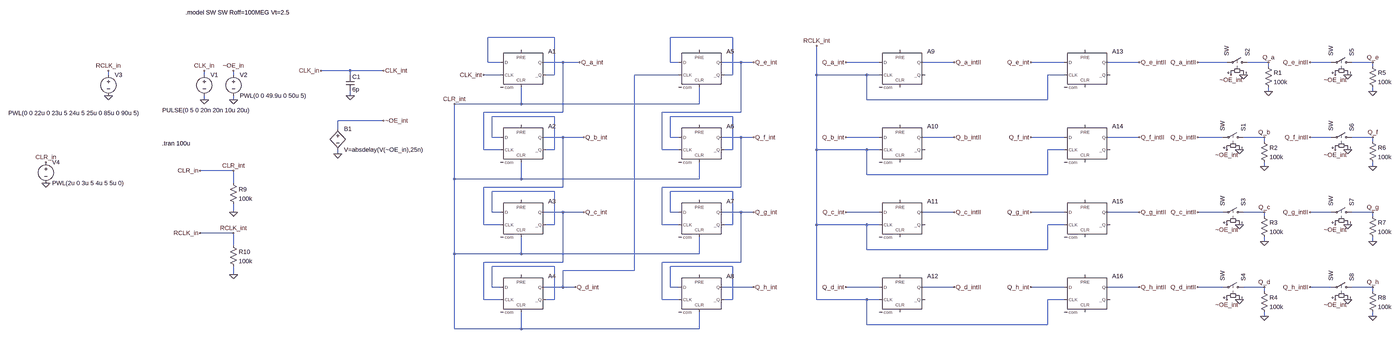
[diagram p0: schematic Draft4.asc, whole sheet]
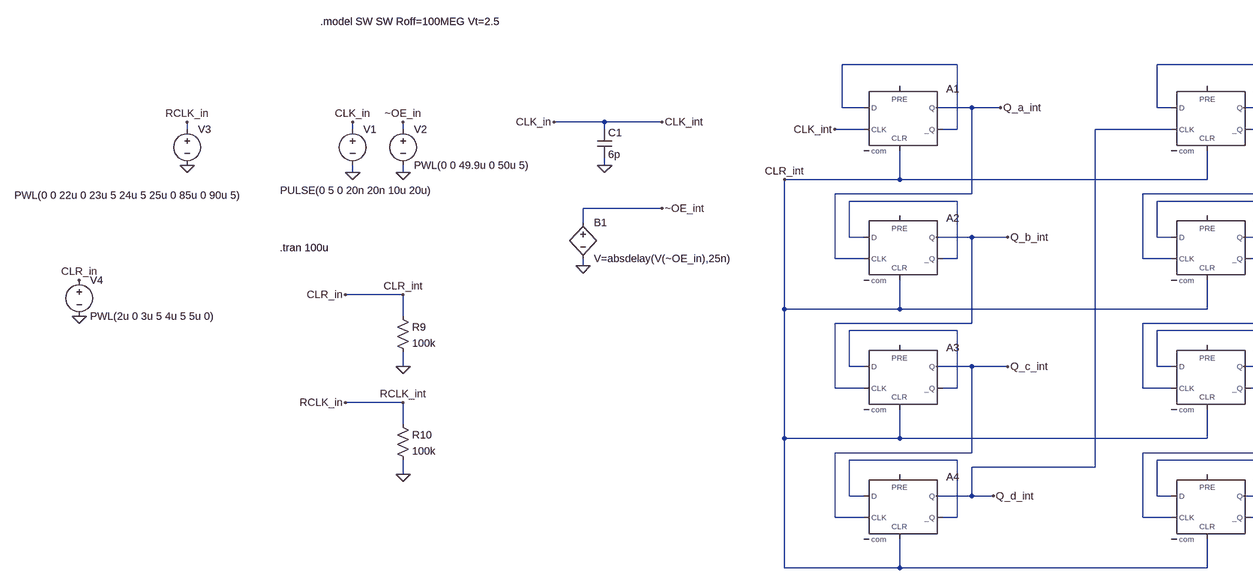
[diagram p1: schematic Draft4.asc, part, row 1 of 1, column 1 of 2]
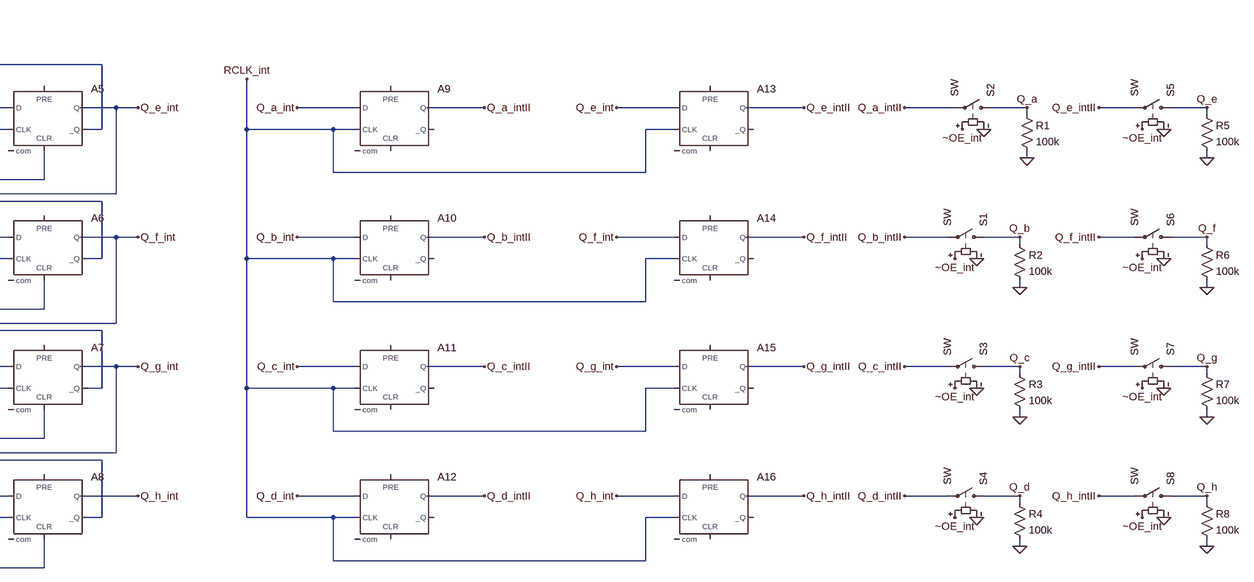
[diagram p2: schematic Draft4.asc, part, row 1 of 1, column 2 of 2]
Draft4.asc, the LTspice schematic file:
Version 4
SHEET 1 3744 1060
WIRE 304 -96 48 -96
WIRE 1088 -96 848 -96
WIRE 48 0 48 -96
WIRE 96 0 48 0
WIRE 336 0 256 0
WIRE 400 0 336 0
WIRE 848 0 848 -96
WIRE 880 0 848 0
WIRE 1120 0 1040 0
WIRE 1168 0 1120 0
WIRE 1760 0 1632 0
WIRE 2048 0 1920 0
WIRE 2480 0 2352 0
WIRE 2768 0 2640 0
WIRE 3104 0 2992 0
WIRE 3264 0 3184 0
WIRE 3504 0 3424 0
WIRE 3664 0 3584 0
WIRE 3264 16 3264 0
WIRE 3664 16 3664 0
WIRE -480 32 -592 32
WIRE -352 32 -480 32
WIRE -1408 48 -1408 32
WIRE -1040 48 -1040 32
WIRE -928 48 -928 32
WIRE -480 48 -480 32
WIRE 96 48 32 48
WIRE 304 48 304 -96
WIRE 304 48 272 48
WIRE 880 48 704 48
WIRE 1088 48 1088 -96
WIRE 1088 48 1056 48
WIRE 1520 48 1520 -64
WIRE 1712 48 1520 48
WIRE 1760 48 1712 48
WIRE 2480 48 2416 48
WIRE 3264 112 3264 96
WIRE 3664 112 3664 96
WIRE -480 128 -480 112
WIRE -1040 144 -1040 128
WIRE -928 144 -928 128
WIRE 1712 144 1712 48
WIRE 2416 144 2416 48
WIRE 2416 144 1712 144
WIRE 176 160 176 96
WIRE 176 160 -80 160
WIRE 960 160 960 96
WIRE 960 160 176 160
WIRE 336 192 336 0
WIRE 336 192 32 192
WIRE 1120 192 1120 0
WIRE 1120 192 816 192
WIRE 304 208 64 208
WIRE 1088 208 848 208
WIRE -352 224 -528 224
WIRE -528 256 -528 224
WIRE 64 288 64 208
WIRE 96 288 64 288
WIRE 336 288 256 288
WIRE 416 288 336 288
WIRE 848 288 848 208
WIRE 880 288 848 288
WIRE 1120 288 1040 288
WIRE 1168 288 1120 288
WIRE 1760 288 1632 288
WIRE 2048 288 1920 288
WIRE 2480 288 2352 288
WIRE 2768 288 2640 288
WIRE 3088 288 2992 288
WIRE 3248 288 3168 288
WIRE 3504 288 3424 288
WIRE 3664 288 3584 288
WIRE 3248 304 3248 288
WIRE 3664 304 3664 288
WIRE 32 336 32 192
WIRE 96 336 32 336
WIRE 304 336 304 208
WIRE 304 336 272 336
WIRE 816 336 816 192
WIRE 880 336 816 336
WIRE 1088 336 1088 208
WIRE 1088 336 1056 336
WIRE 1520 336 1520 48
WIRE 1712 336 1520 336
WIRE 1760 336 1712 336
WIRE 2480 336 2416 336
WIRE -528 352 -528 336
WIRE 3248 400 3248 384
WIRE 3664 400 3664 384
WIRE -928 416 -1056 416
WIRE 1712 432 1712 336
WIRE 2416 432 2416 336
WIRE 2416 432 1712 432
WIRE -80 448 -80 160
WIRE 176 448 176 384
WIRE 176 448 -80 448
WIRE 960 448 960 384
WIRE 960 448 176 448
WIRE -928 464 -928 416
WIRE 336 480 336 288
WIRE 336 480 32 480
WIRE 1120 480 1120 288
WIRE 1120 480 816 480
WIRE 304 496 64 496
WIRE 1088 496 848 496
WIRE -928 576 -928 544
WIRE 64 576 64 496
WIRE 96 576 64 576
WIRE 336 576 256 576
WIRE 416 576 336 576
WIRE 848 576 848 496
WIRE 880 576 848 576
WIRE 1120 576 1040 576
WIRE 1168 576 1120 576
WIRE 1760 576 1632 576
WIRE 2048 576 1920 576
WIRE 2480 576 2352 576
WIRE 2768 576 2640 576
WIRE 3088 576 2992 576
WIRE 3248 576 3168 576
WIRE 3504 576 3424 576
WIRE 3664 576 3584 576
WIRE 3248 592 3248 576
WIRE 3664 592 3664 576
WIRE 32 624 32 480
WIRE 96 624 32 624
WIRE 304 624 304 496
WIRE 304 624 272 624
WIRE 816 624 816 480
WIRE 880 624 816 624
WIRE 1088 624 1088 496
WIRE 1088 624 1056 624
WIRE 1520 624 1520 336
WIRE 1712 624 1520 624
WIRE 1760 624 1712 624
WIRE 2480 624 2416 624
WIRE -928 656 -1056 656
WIRE 3248 688 3248 672
WIRE 3664 688 3664 672
WIRE -928 704 -928 656
WIRE 1712 720 1712 624
WIRE 2416 720 2416 624
WIRE 2416 720 1712 720
WIRE -80 736 -80 448
WIRE 176 736 176 672
WIRE 176 736 -80 736
WIRE 960 736 960 672
WIRE 960 736 176 736
WIRE 336 768 336 576
WIRE 336 768 32 768
WIRE 1120 768 1120 576
WIRE 1120 768 816 768
WIRE 304 784 64 784
WIRE 1088 784 848 784
WIRE 704 800 704 48
WIRE 704 800 336 800
WIRE -928 816 -928 784
WIRE 64 864 64 784
WIRE 96 864 64 864
WIRE 336 864 336 800
WIRE 336 864 256 864
WIRE 384 864 336 864
WIRE 848 864 848 784
WIRE 880 864 848 864
WIRE 1168 864 1040 864
WIRE 1760 864 1632 864
WIRE 2048 864 1920 864
WIRE 2480 864 2352 864
WIRE 2768 864 2640 864
WIRE 3088 864 2992 864
WIRE 3248 864 3168 864
WIRE 3504 864 3424 864
WIRE 3664 864 3584 864
WIRE 3248 880 3248 864
WIRE 3664 880 3664 864
WIRE 32 912 32 768
WIRE 96 912 32 912
WIRE 304 912 304 784
WIRE 304 912 272 912
WIRE 816 912 816 768
WIRE 880 912 816 912
WIRE 1088 912 1088 784
WIRE 1088 912 1056 912
WIRE 1520 912 1520 624
WIRE 1712 912 1520 912
WIRE 1760 912 1712 912
WIRE 2480 912 2416 912
WIRE 3248 976 3248 960
WIRE 3664 976 3664 960
WIRE 1712 1008 1712 912
WIRE 2416 1008 2416 912
WIRE 2416 1008 1712 1008
WIRE -80 1024 -80 736
WIRE 176 1024 176 960
WIRE 176 1024 -80 1024
WIRE 960 1024 960 960
WIRE 960 1024 176 1024
FLAG -592 32 CLK_in
FLAG -352 32 CLK_int
FLAG 32 48 CLK_int
FLAG -480 128 0
FLAG -352 224 ~OE_int
FLAG 3120 48 ~OE_int
FLAG 400 0 Q_a_int
FLAG -928 144 0
FLAG -1040 144 0
FLAG -1040 32 CLK_in
FLAG -928 32 ~OE_in
FLAG -528 352 0
FLAG 3168 48 0
FLAG 3264 112 0
FLAG 3104 336 ~OE_int
FLAG 416 288 Q_b_int
FLAG 3152 336 0
FLAG 3248 400 0
FLAG 3104 624 ~OE_int
FLAG 416 576 Q_c_int
FLAG 3152 624 0
FLAG 3248 688 0
FLAG 3104 912 ~OE_int
FLAG 384 864 Q_d_int
FLAG 3152 912 0
FLAG 3248 976 0
FLAG 3520 48 ~OE_int
FLAG 1168 0 Q_e_int
FLAG 3568 48 0
FLAG 3664 112 0
FLAG 3520 336 ~OE_int
FLAG 1168 288 Q_f_int
FLAG 3568 336 0
FLAG 3664 400 0
FLAG 3520 624 ~OE_int
FLAG 1168 576 Q_g_int
FLAG 3568 624 0
FLAG 3664 688 0
FLAG 3520 912 ~OE_int
FLAG 1168 864 Q_h_int
FLAG 3568 912 0
FLAG 3664 976 0
FLAG -80 160 CLR_int
FLAG -1056 416 CLR_in
FLAG -928 576 0
FLAG 1632 0 Q_a_int
FLAG 1632 288 Q_b_int
FLAG 1632 576 Q_c_int
FLAG 1632 864 Q_d_int
FLAG -1056 656 RCLK_in
FLAG -928 816 0
FLAG -928 416 CLR_int
FLAG -928 656 RCLK_int
FLAG 1520 -64 RCLK_int
FLAG 2048 0 Q_a_intII
FLAG 2048 288 Q_b_intII
FLAG 2048 576 Q_c_intII
FLAG 2048 864 Q_d_intII
FLAG 2352 0 Q_e_int
FLAG 2352 288 Q_f_int
FLAG 2352 576 Q_g_int
FLAG 2352 864 Q_h_int
FLAG 2768 0 Q_e_intII
FLAG 2768 288 Q_f_intII
FLAG 2768 576 Q_g_intII
FLAG 2768 864 Q_h_intII
FLAG 3424 0 Q_e_intII
FLAG 3424 288 Q_f_intII
FLAG 3424 576 Q_g_intII
FLAG 3424 864 Q_h_intII
FLAG 2992 0 Q_a_intII
FLAG 2992 288 Q_b_intII
FLAG 2992 576 Q_c_intII
FLAG 2992 864 Q_d_intII
FLAG 3264 0 Q_a
FLAG 3248 288 Q_b
FLAG 3248 576 Q_c
FLAG 3248 864 Q_d
FLAG 3664 0 Q_e
FLAG 3664 288 Q_f
FLAG 3664 576 Q_g
FLAG 3664 864 Q_h
FLAG -1408 128 0
FLAG -1408 32 RCLK_in
FLAG -1648 464 0
FLAG -1648 384 CLR_in
SYMBOL Digital\\dflop 176 -48 R0
SYMATTR InstName A1
SYMATTR SpiceLine Vhigh=5 Vlow=0 Td=25n
SYMBOL cap -496 48 R0
SYMATTR InstName C1
SYMATTR Value 6p
SYMBOL sw 3200 0 M270
SYMATTR InstName S2
SYMBOL voltage -1040 32 R0
WINDOW 3 -161 152 Left 2
WINDOW 123 0 0 Left 0
WINDOW 39 0 0 Left 0
SYMATTR InstName V1
SYMATTR Value PULSE(0 5 0 20n 20n 10u 20u)
SYMBOL voltage -928 32 R0
WINDOW 123 0 0 Left 0
WINDOW 39 0 0 Left 0
SYMATTR InstName V2
SYMATTR Value PWL(0 0 49.9u 0 50u 5)
SYMBOL bv -528 240 R0
SYMATTR InstName B1
SYMATTR Value V=absdelay(V(~OE_in),25n)
SYMBOL res 3248 0 R0
SYMATTR InstName R1
SYMATTR Value 100k
SYMBOL Digital\\dflop 176 240 R0
SYMATTR InstName A2
SYMATTR SpiceLine Vhigh=5 Vlow=0 Td=25n
SYMBOL sw 3184 288 M270
SYMATTR InstName S1
SYMBOL res 3232 288 R0
SYMATTR InstName R2
SYMATTR Value 100k
SYMBOL Digital\\dflop 176 528 R0
SYMATTR InstName A3
SYMATTR SpiceLine Vhigh=5 Vlow=0 Td=25n
SYMBOL sw 3184 576 M270
SYMATTR InstName S3
SYMBOL res 3232 576 R0
SYMATTR InstName R3
SYMATTR Value 100k
SYMBOL Digital\\dflop 176 816 R0
SYMATTR InstName A4
SYMATTR SpiceLine Vhigh=5 Vlow=0 Td=25n
SYMBOL sw 3184 864 M270
SYMATTR InstName S4
SYMBOL res 3232 864 R0
SYMATTR InstName R4
SYMATTR Value 100k
SYMBOL Digital\\dflop 960 -48 R0
SYMATTR InstName A5
SYMATTR SpiceLine Vhigh=5 Vlow=0 Td=25n
SYMBOL sw 3600 0 M270
SYMATTR InstName S5
SYMBOL res 3648 0 R0
SYMATTR InstName R5
SYMATTR Value 100k
SYMBOL Digital\\dflop 960 240 R0
SYMATTR InstName A6
SYMATTR SpiceLine Vhigh=5 Vlow=0 Td=25n
SYMBOL sw 3600 288 M270
SYMATTR InstName S6
SYMBOL res 3648 288 R0
SYMATTR InstName R6
SYMATTR Value 100k
SYMBOL Digital\\dflop 960 528 R0
SYMATTR InstName A7
SYMATTR SpiceLine Vhigh=5 Vlow=0 Td=25n
SYMBOL sw 3600 576 M270
SYMATTR InstName S7
SYMBOL res 3648 576 R0
SYMATTR InstName R7
SYMATTR Value 100k
SYMBOL Digital\\dflop 960 816 R0
SYMATTR InstName A8
SYMATTR SpiceLine Vhigh=5 Vlow=0 Td=25n
SYMBOL sw 3600 864 M270
SYMATTR InstName S8
SYMBOL res 3648 864 R0
SYMATTR InstName R8
SYMATTR Value 100k
SYMBOL res -944 448 R0
SYMATTR InstName R9
SYMATTR Value 100k
SYMBOL Digital\\dflop 1840 -48 R0
SYMATTR InstName A9
SYMATTR SpiceLine Vhigh=5 Vlow=0 Td=25n
SYMBOL Digital\\dflop 1840 240 R0
SYMATTR InstName A10
SYMATTR SpiceLine Vhigh=5 Vlow=0 Td=25n
SYMBOL Digital\\dflop 1840 528 R0
SYMATTR InstName A11
SYMATTR SpiceLine Vhigh=5 Vlow=0 Td=25n
SYMBOL Digital\\dflop 1840 816 R0
SYMATTR InstName A12
SYMATTR SpiceLine Vhigh=5 Vlow=0 Td=25n
SYMBOL res -944 688 R0
SYMATTR InstName R10
SYMATTR Value 100k
SYMBOL Digital\\dflop 2560 -48 R0
SYMATTR InstName A13
SYMATTR SpiceLine Vhigh=5 Vlow=0 Td=25n
SYMBOL Digital\\dflop 2560 240 R0
SYMATTR InstName A14
SYMATTR SpiceLine Vhigh=5 Vlow=0 Td=25n
SYMBOL Digital\\dflop 2560 528 R0
SYMATTR InstName A15
SYMATTR SpiceLine Vhigh=5 Vlow=0 Td=25n
SYMBOL Digital\\dflop 2560 816 R0
SYMATTR InstName A16
SYMATTR SpiceLine Vhigh=5 Vlow=0 Td=25n
SYMBOL voltage -1408 32 R0
WINDOW 3 -384 163 Left 2
WINDOW 123 0 0 Left 0
WINDOW 39 0 0 Left 0
SYMATTR InstName V3
SYMATTR Value PWL(0 0 22u 0 23u 5 24u 5 25u 0 85u 0 90u 5)
SYMBOL voltage -1648 368 R0
WINDOW 123 0 0 Left 0
WINDOW 39 0 0 Left 0
SYMATTR InstName V4
SYMATTR Value PWL(2u 0 3u 5 4u 5 5u 0)
TEXT -1202 312 Left 2 !.tran 100u
TEXT -1112 -192 Left 2 !.model SW SW Roff=100MEG Vt=2.5

The netlist it stands for:
* Draft4.asc
A1 N001 0 CLK_int 0 CLR_in N001 Q_a_int 0 DFLOP Vhigh=5 Vlow=0 Td=25n
C1 CLK_int 0 6p
S2 Q_a Q_a_intII ~OE_int 0 SW
V1 CLK_int 0 PULSE(0 5 0 20n 20n 10u 20u)
V2 ~OE_in 0 PWL(0 0 49.9u 0 50u 5)
B1 ~OE_int 0 V=absdelay(V(~OE_in),25n)
R1 Q_a 0 100k
A2 N003 0 Q_a_int 0 CLR_in N003 Q_b_int 0 DFLOP Vhigh=5 Vlow=0 Td=25n
S1 Q_b Q_b_intII ~OE_int 0 SW
R2 Q_b 0 100k
A3 N005 0 Q_b_int 0 CLR_in N005 Q_c_int 0 DFLOP Vhigh=5 Vlow=0 Td=25n
S3 Q_c Q_c_intII ~OE_int 0 SW
R3 Q_c 0 100k
A4 N007 0 Q_c_int 0 CLR_in N007 Q_d_int 0 DFLOP Vhigh=5 Vlow=0 Td=25n
S4 Q_d Q_d_intII ~OE_int 0 SW
R4 Q_d 0 100k
A5 N002 0 Q_d_int 0 CLR_in N002 Q_e_int 0 DFLOP Vhigh=5 Vlow=0 Td=25n
S5 Q_e Q_e_intII ~OE_int 0 SW
R5 Q_e 0 100k
A6 N004 0 Q_e_int 0 CLR_in N004 Q_f_int 0 DFLOP Vhigh=5 Vlow=0 Td=25n
S6 Q_f Q_f_intII ~OE_int 0 SW
R6 Q_f 0 100k
A7 N006 0 Q_f_int 0 CLR_in N006 Q_g_int 0 DFLOP Vhigh=5 Vlow=0 Td=25n
S7 Q_g Q_g_intII ~OE_int 0 SW
R7 Q_g 0 100k
A8 N008 0 Q_g_int 0 CLR_in N008 Q_h_int 0 DFLOP Vhigh=5 Vlow=0 Td=25n
S8 Q_h Q_h_intII ~OE_int 0 SW
R8 Q_h 0 100k
R9 CLR_in 0 100k
A9 Q_a_int 0 RCLK_int 0 0 0 Q_a_intII 0 DFLOP Vhigh=5 Vlow=0 Td=25n
A10 Q_b_int 0 RCLK_int 0 0 0 Q_b_intII 0 DFLOP Vhigh=5 Vlow=0 Td=25n
A11 Q_c_int 0 RCLK_int 0 0 0 Q_c_intII 0 DFLOP Vhigh=5 Vlow=0 Td=25n
A12 Q_d_int 0 RCLK_int 0 0 0 Q_d_intII 0 DFLOP Vhigh=5 Vlow=0 Td=25n
R10 RCLK_int 0 100k
A13 Q_e_int 0 RCLK_int 0 0 0 Q_e_intII 0 DFLOP Vhigh=5 Vlow=0 Td=25n
A14 Q_f_int 0 RCLK_int 0 0 0 Q_f_intII 0 DFLOP Vhigh=5 Vlow=0 Td=25n
A15 Q_g_int 0 RCLK_int 0 0 0 Q_g_intII 0 DFLOP Vhigh=5 Vlow=0 Td=25n
A16 Q_h_int 0 RCLK_int 0 0 0 Q_h_intII 0 DFLOP Vhigh=5 Vlow=0 Td=25n
V3 RCLK_int 0 PWL(0 0 22u 0 23u 5 24u 5 25u 0 85u 0 90u 5)
V4 CLR_in 0 PWL(2u 0 3u 5 4u 5 5u 0)
.tran 100u
.model SW SW Roff=100MEG Vt=2.5
.backanno
.end